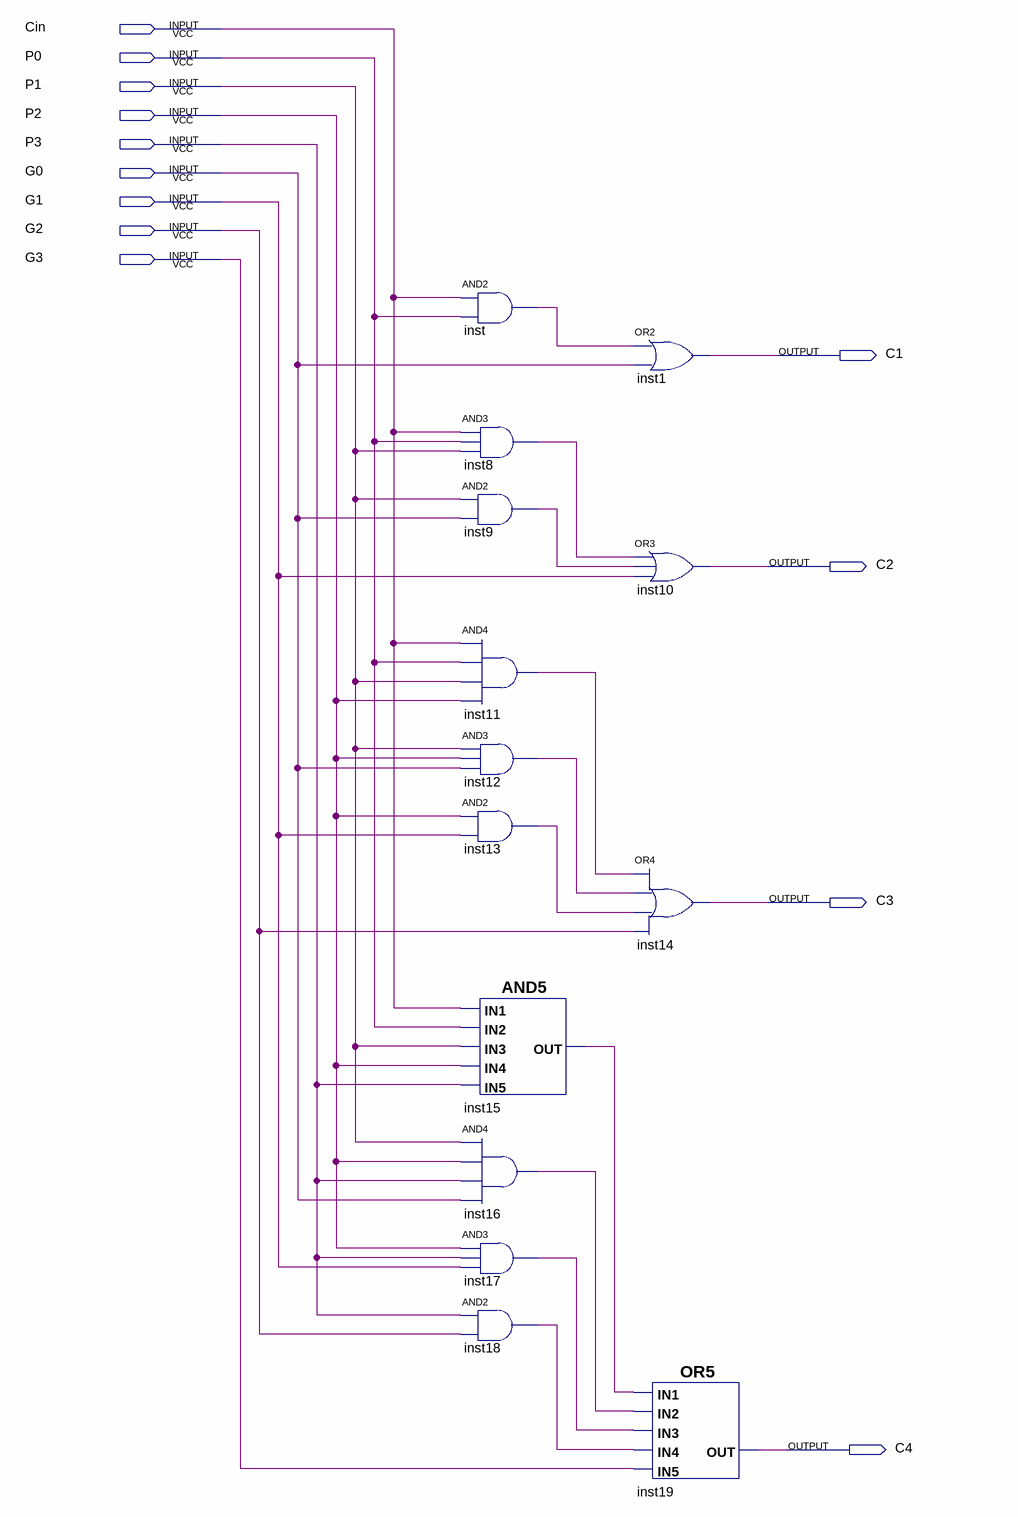
[diagram p0: schematic sheet]
// Quartus schematic PG4.bdf as structural Verilog: 14 symbols, 13 pins
module PG4 (
  input  Cin,
  input  P0,
  input  P1,
  input  P2,
  input  P3,
  input  G0,
  input  G1,
  input  G2,
  input  G3,
  output C1,
  output C2,
  output C3,
  output C4
);

  wire inst8_out, inst9_out, inst11_out, inst12_out, inst13_out, inst15_out, inst16_out, inst17_out,
       inst18_out, inst_out;

  and inst (inst_out, Cin, P0);
  and inst8 (inst8_out, Cin, P0, P1);
  and inst9 (inst9_out, P1, G0);
  and inst11 (inst11_out, Cin, P0, P1, P2);
  and inst12 (inst12_out, P1, P2, G0);
  and inst13 (inst13_out, P2, G1);
  and inst15 (inst15_out, Cin, P0, P1, P2, P3);
  and inst16 (inst16_out, P1, P2, P3, G0);
  and inst17 (inst17_out, P2, P3, G1);
  and inst18 (inst18_out, P3, G2);
  or inst1 (C1, inst_out, G0);
  or inst10 (C2, inst8_out, inst9_out, G1);
  or inst14 (C3, inst11_out, inst12_out, inst13_out, G2);
  or inst19 (C4, inst15_out, inst16_out, inst17_out, inst18_out, G3);
endmodule
